# EAGLE design SV60mALEDs (EAGLE 7.6.0)
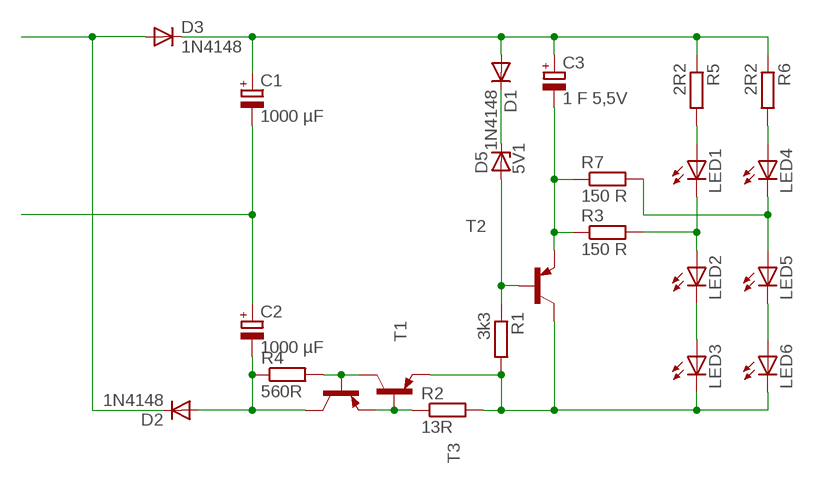
[diagram p0: schematic, sheet 1]

## Parts
C1  1000 µF  CPOL-EUE5-10.5  [E5-10,5]
C2  1000 µF  CPOL-EUE5-10.5  [E5-10,5]
C3  1 F 5,5V  CPOL-EUE3.5-10  [E3,5-10]
D1  1N4148  1N4148DO35-10  [DO35-10]
D2  1N4148  1N4148DO35-10  [DO35-10]
D3  1N4148  1N4148DO35-10  [DO35-10]
D5  5V1  BZD23  [SOD81]
LED1  LED5MM  [LED5MM]
LED2  LED5MM  [LED5MM]
LED3  LED5MM  [LED5MM]
LED4  LED5MM  [LED5MM]
LED5  LED5MM  [LED5MM]
LED6  LED5MM  [LED5MM]
R1  3k3  R-EU_0207/10  [0207/10]
R2  13R  R-EU_0207/10  [0207/10]
R3  150 R  R-EU_0207/10  [0207/10]
R4  560R  R-EU_0207/12  [0207/12]
R5  2R2  R-EU_0207/10  [0207/10]
R6  2R2  R-EU_0207/10  [0207/10]
R7  150 R  R-EU_0207/10  [0207/10]
T1  2N2907-PNP-TO18-EBC  [TO18]
T2  2N2907-PNP-TO18-EBC  [TO18]
T3  2N2907-PNP-TO18-EBC  [TO18]

## Nets
D1: D2.C D3.A
D2: C1.- C2.+
LV1: LED1.K(C) LED2.A R3.2
LV2: LED3.K(C) LED6.K(C) R1.2 R2.2 T2.3(C) T3.1(E)
N$1: C1.+ C3.+ D1.A D3.C R5.1 R6.1
N$2: C3.- R3.1 R7.1 T2.1(E)
N$3: C2.- D2.A R4.1 T1.3(C)
N$4: R4.2 T1.2(B) T3.3(C)
N$5: D5.A R1.1 T2.2(B)
N$6: D1.C D5.C
N$7: R2.1 T1.1(E) T3.2(B)
N$8: LED1.A R5.2
N$9: LED4.A R6.2
N$10: LED2.K(C) LED3.A
N$11: LED5.K(C) LED6.A
N$12: LED4.K(C) LED5.A R7.2

## Library data of the parts
C1-C3 = rcl:CPOL-EU: POLARIZED CAPACITOR, European symbol
D1-D3 = diode:1N4148: DIODE high speed (Philips)
D5 = diode:BZD23: Z DIODE
LED1-LED6 = led:LED: LED OSRAM: - CHIPLED LG R971, LG N971, LY N971, LG Q971, LY Q971, LO R971, LY R971 LH N974, LH R974 LS Q976, LO Q976, LY Q976 LO Q996 - Hyper CHIPLED LW Q18S LB Q993, LB Q99A, LB R99A - SideLED LS A670, LO A670, LY A670, LG A670, LP A670 LB A673, LV A673, LT A673, LW A673 LH A674 LY A675 LS A676, LA A676, LO A676, LY A676, LW A676 LS A679, LY A679, LG A679 - Hyper Micro SIDELED® LS Y876, LA Y876, LO Y876, LY Y876 LT Y87S - SmartLED LW L88C, LW L88S LB L89C, LB L89S, LG L890 LS L89K, LO L89K, LY L89K LS L896, LA L896, LO L896, LY L896 - TOPLED LS T670, LO T670, LY T670, LG T670, LP T670 LSG T670, LSP T670, LSY T670, LOP T670, LYG T670 LG T671, LOG T671, LSG T671 LB T673, LV T673, LT T673, LW T673 LH T674 LS T676, LA T676, LO T676, LY T676, LB T676, LH T676, LSB T676, LW T676 LB T67C, LV T67C, LT T67C, LS T67K, LO T67K, LY T67K, LW E67C LS E67B, LA E67B, LO E67B, LY E67B, LB E67C, LV E67C, LT E67C LW T67C LS T679, LY T679, LG T679 LS T770, LO T770, LY T770, LG T770, LP T770 LB T773, LV T773, LT T773, LW T773 LH T774 LS E675, LA E675, LY E675, LS T675 LS T776, LA T776, LO T776, LY T776, LB T776 LHGB T686 LT T68C, LB T68C - Hyper Mini TOPLED® LB M676 - Mini TOPLED Santana® LG M470 LS M47K, LO M47K, LY M47K Source: http://www.osram.convergy.de LUXEON: - LUMILED® LXK2-PW12-R00, LXK2-PW12-S00, LXK2-PW14-U00, LXK2-PW14-V00 LXK2-PM12-R00, LXK2-PM12-S00, LXK2-PM14-U00 LXK2-PE12-Q00, LXK2-PE12-R00, LXK2-PE12-S00, LXK2-PE14-T00, LXK2-PE14-U00 LXK2-PB12-K00, LXK2-PB12-L00, LXK2-PB12-M00, LXK2-PB14-N00, LXK2-PB14-P00, LXK2-PB14-Q00 LXK2-PR12-L00, LXK2-PR12-M00, LXK2-PR14-Q00, LXK2-PR14-R00 LXK2-PD12-Q00, LXK2-PD12-R00, LXK2-PD12-S00 LXK2-PH12-R00, LXK2-PH12-S00 LXK2-PL12-P00, LXK2-PL12-Q00, LXK2-PL12-R00 Source: www.luxeon.com KINGBRIGHT: KA-3528ASYC Source: www.kingbright.com
R1-R7 = rcl:R-EU_: RESISTOR, European symbol
T1-T3 = transistor:*-PNP-: PNP Transistror

## Board
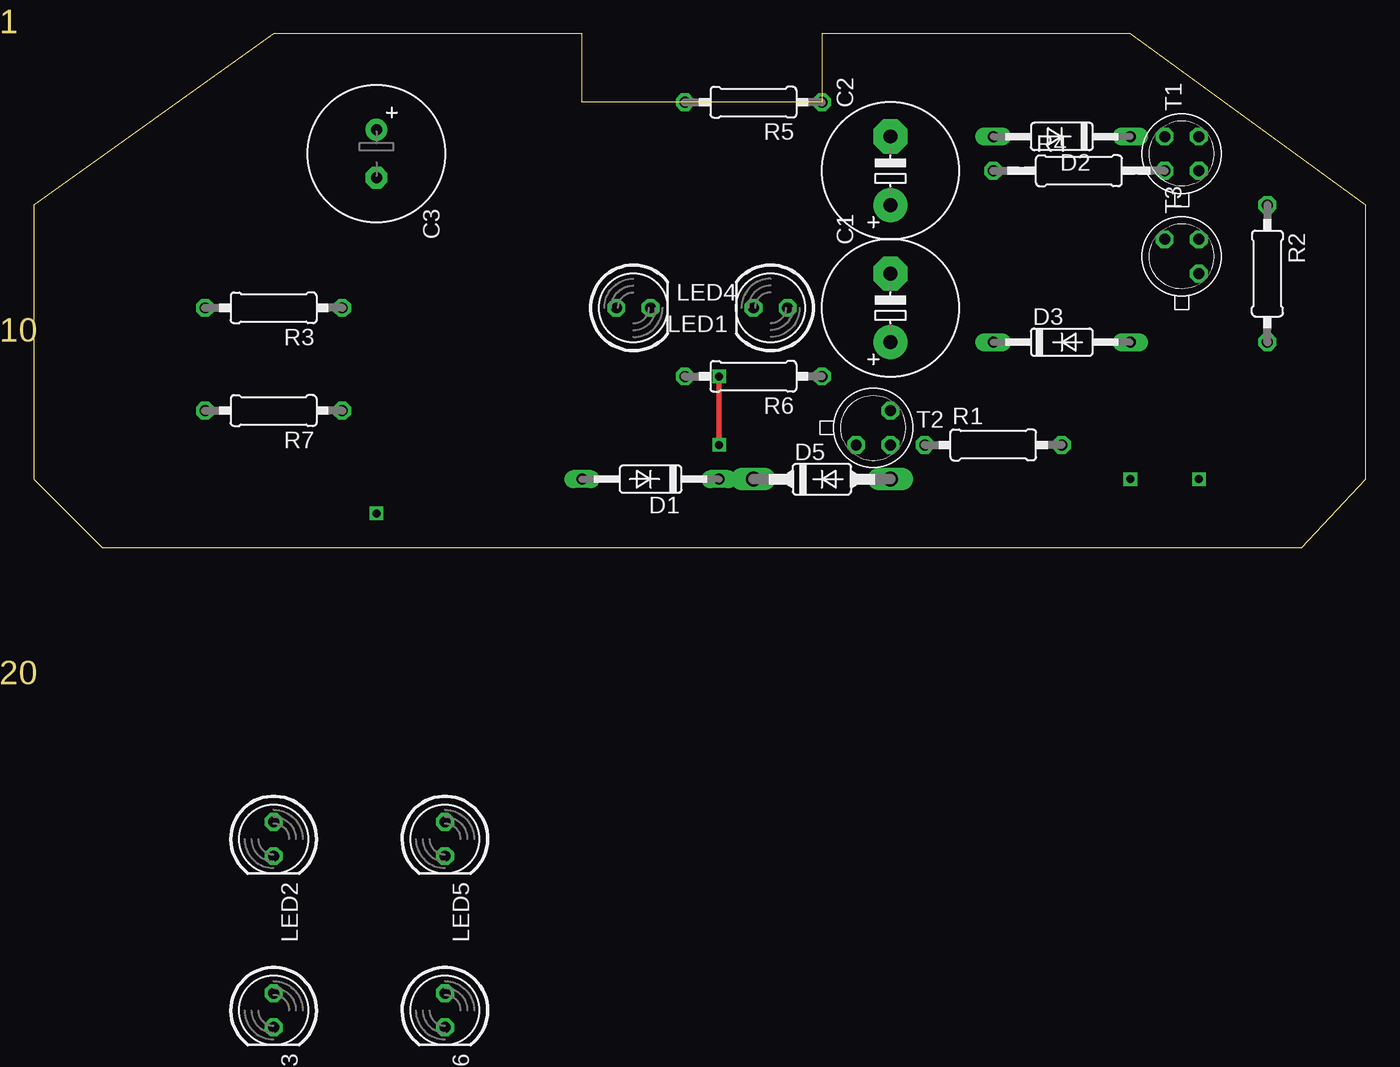
[diagram p1: board, top side]
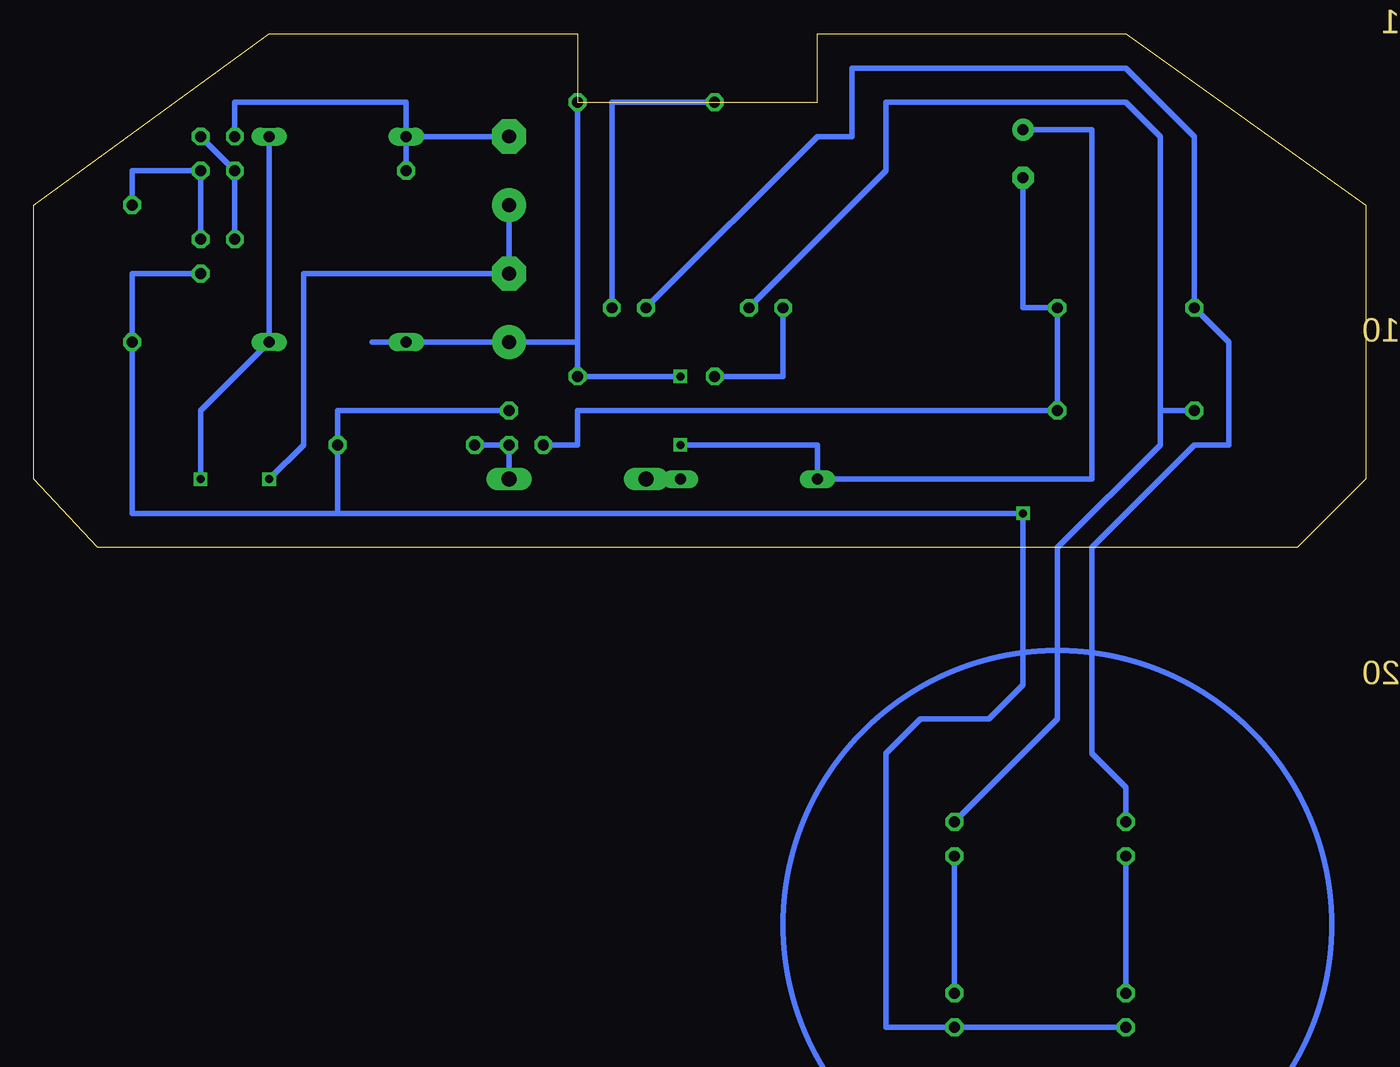
[diagram p2: board, bottom side, seen from below]

Size 98.73 x 38.1 mm. Coordinates in mm from the lower left corner, seen from the top.
Outline: 5.08,0 93.98,0 98.73,5.08 98.73,25.39 81.28,38.09 81.28,38.1 58.42,38.1 58.42,33.02 40.64,33.02 40.64,38.1 17.78,38.1 17.78,38.09 0,25.39 0,5.08 5.08,0
Copper layers (1*16): Top 0.035mm / dielectric 1.5mm / Bottom 0.035mm
Design rules "default": minimum track width 10mil, minimum drill 24mil, track to track 8mil, track to pad 8mil, pad to pad 8mil, via to via 8mil, smd to smd 8mil, copper to edge 40mil, drill to drill 8mil, minimum pad ring 10mil, minimum via ring 8mil, stop-mask expansion 4mil, vias tented up to drill 0mil, thermal gap 10mil

### Footprints (pad centres in the part's own frame; a part is rotated, then mirrored left to right if it is on the bottom)
E5-10,5 = drill 1.016 pad 2.54: + -2.54,0 | drill 1.016 pad 2.54 octagon: - 2.54,0
E3,5-10 = drill 0.813 pad 1.6: + -1.778,0 | drill 0.813 pad 1.6 octagon: - 1.778,0
DO35-10 = drill 0.813 long: A 5.08,0; C -5.08,0
SOD81 = drill 1.118 long: A 5.08,0; C -5.08,0
LED5MM = drill 0.813 octagon: A -1.27,0; K 1.27,0
0207/10 = drill 0.813 octagon: 1 -5.08,0; 2 5.08,0
0207/12 = drill 0.813 octagon: 1 -6.35,0; 2 6.35,0
TO18 = drill 0.813 octagon: 1 -1.27,-1.27; 2 1.27,-1.27; 3 1.27,1.27

### Placement (x,y rotation side)
C1  63.5,17.78 90 top
C2  63.5,27.94 90 top
C3  25.4,29.21 270 top
D1  45.72,5.08 180 top
D2  76.2,30.48 180 top
D3  76.2,15.24 0 top
D5  58.42,5.08 0 top
LED1  54.61,17.78 180 top
LED2  17.78,-21.59 270 top  (outside the outline)
LED3  17.78,-34.29 270 top  (outside the outline)
LED4  44.45,17.78 0 top
LED5  30.48,-21.59 270 top  (outside the outline)
LED6  30.48,-34.29 270 top  (outside the outline)
R1  71.12,7.62 0 top
R2  91.44,20.32 270 top
R3  17.78,17.78 180 top
R4  77.47,27.94 0 top
R5  53.34,33.02 180 top
R6  53.34,12.7 180 top
R7  17.78,10.16 180 top
T1  85.09,29.21 90 top
T2  62.23,8.89 0 top
T3  85.09,21.59 90 top

### Tracks (layer width: path | path; a pad name or v marks a point on that pad's centre or on a via)
D1  (via drill 0.6)
  Bottom 0.406: D2.C D3.A 86.36,10.16 v86.36,5.08
D2  (via drill 0.6)
  Bottom 0.406: C2.+ C1.- 78.74,20.32 78.74,7.62 v81.28,5.08
LV1
  Bottom 0.406: LED1.K 40.64,30.48 38.1,30.48 38.1,35.56 17.78,35.56 12.7,30.48 R3.2 10.16,15.24 10.16,7.62 12.7,7.62 20.32,0 20.32,-15.24 17.78,-17.78 LED2.A
LV2  (via drill 0.6)
  Bottom 0.406: LED6.K LED3.K 35.56,-35.56 35.56,-15.24 33.02,-12.7 27.94,-12.7 25.4,-10.16 v25.4,2.54 76.2,2.54 | T2.3 76.2,10.16 R1.2 76.2,2.54 | 76.2,2.54 91.44,2.54 R2.2 91.44,20.32 T3.1
N$1  (via drill 0.6)
  Top 0.406: v50.8,12.7 v50.8,7.62
  Bottom 0.406: 73.66,15.24 D3.C C1.+ 58.42,15.24 R6.1 | R6.1 R5.1 | R6.1 v50.8,12.7 | v50.8,7.62 40.64,7.62 D1.A 20.32,5.08 20.32,30.99 C3.+
N$2
  Bottom 0.406: T2.1 58.42,7.62 58.42,10.16 R7.1 R3.1 25.4,17.78 C3.-
N$3
  Bottom 0.406: D2.A C2.- | T1.3 83.82,33.02 71.12,33.02 D2.A | D2.A R4.1
N$4
  Bottom 0.406: T1.2 R4.2 T3.3
N$5
  Bottom 0.406: R1.1 T2.2 D5.A
N$6
  Bottom 0.406: D5.C D1.C
N$7
  Bottom 0.406: T3.2 T1.1 91.44,27.94 R2.1
N$8
  Bottom 0.406: LED1.A 55.88,33.02 R5.2
N$9
  Bottom 0.406: LED4.A 43.18,12.7 R6.2
N$10
  Bottom 0.406: LED3.A LED2.K
N$11
  Bottom 0.406: LED5.K LED6.A
N$12
  Bottom 0.406: LED4.K 35.56,27.94 35.56,33.02 17.78,33.02 15.24,30.48 15.24,10.16 | 15.24,10.16 R7.2 | LED5.A 22.86,-12.7 22.86,0 15.24,7.62 15.24,10.16
(copper drawn outside any net)
  shapes: Bottom circle x1

### Text on the board
Dimension: 1 | 10 | 20 | 30 | 39 | 1 | 10 | 20